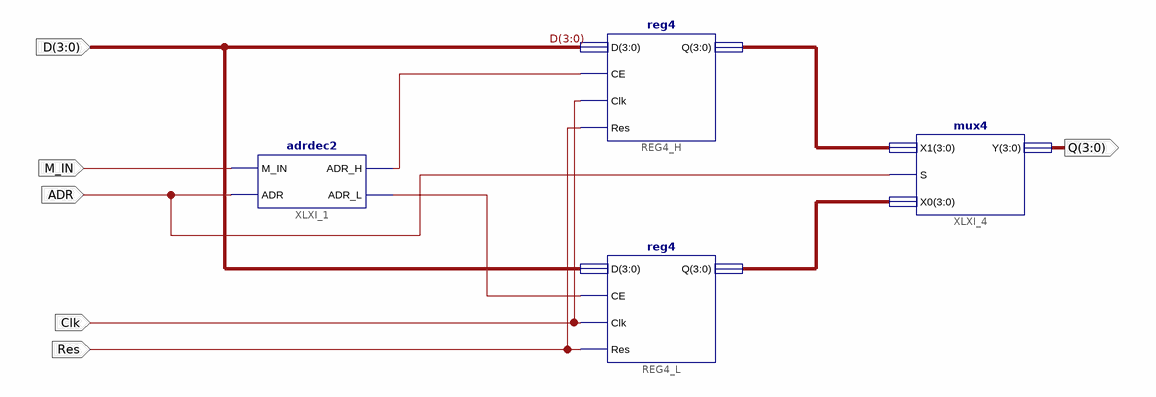
[diagram p0: schematic sheet 1]
// Xilinx ISE schematic ram2.sch (spartan3e) as structural Verilog: 4 symbols, 6 ports
module ram2 (
  input  M_IN,
  input  ADR,
  input  [3:0] D,
  input  Clk,
  input  Res,
  output [3:0] Q
);

  wire XLXN_1, XLXN_2;
  wire [3:0] XLXN_3, XLXN_4;

  adrdec2 XLXI_1 (.ADR(ADR), .ADR_H(XLXN_1), .ADR_L(XLXN_2), .M_IN(M_IN));
  reg4 REG4_H (.Clk(Clk), .CE(XLXN_1), .Res(Res), .D(D), .Q(XLXN_3));
  reg4 REG4_L (.Clk(Clk), .CE(XLXN_2), .Res(Res), .D(D), .Q(XLXN_4));
  mux4 XLXI_4 (.S(ADR), .X0(XLXN_4), .X1(XLXN_3), .Y(Q));
endmodule
